# Altium schematic sheet Sheet1.SchDoc
size 594 x 420 mm; PageSetup: Record=PageOptions|CenterHorizontal=True|CenterVertical=True|PrintScale=0.94|XCorrection=1.00|YCorrection=1.00|PrintKind=1|BorderSize=5000000|LeftOffset=0|BottomOffset=0|Orientation=1|PaperLength=1000|PaperWidth=1000|Scale=100|PaperSource=7|PrintQuality=-4|MediaType=1|DitherType=10|PaperKind=A4|PrintScaleMode=1; Address1: Address1; Address2: Address2; Address3: Address3; Address4: Address4; DocumentNumber: 1; SheetNumber: 1; SheetTotal: 5
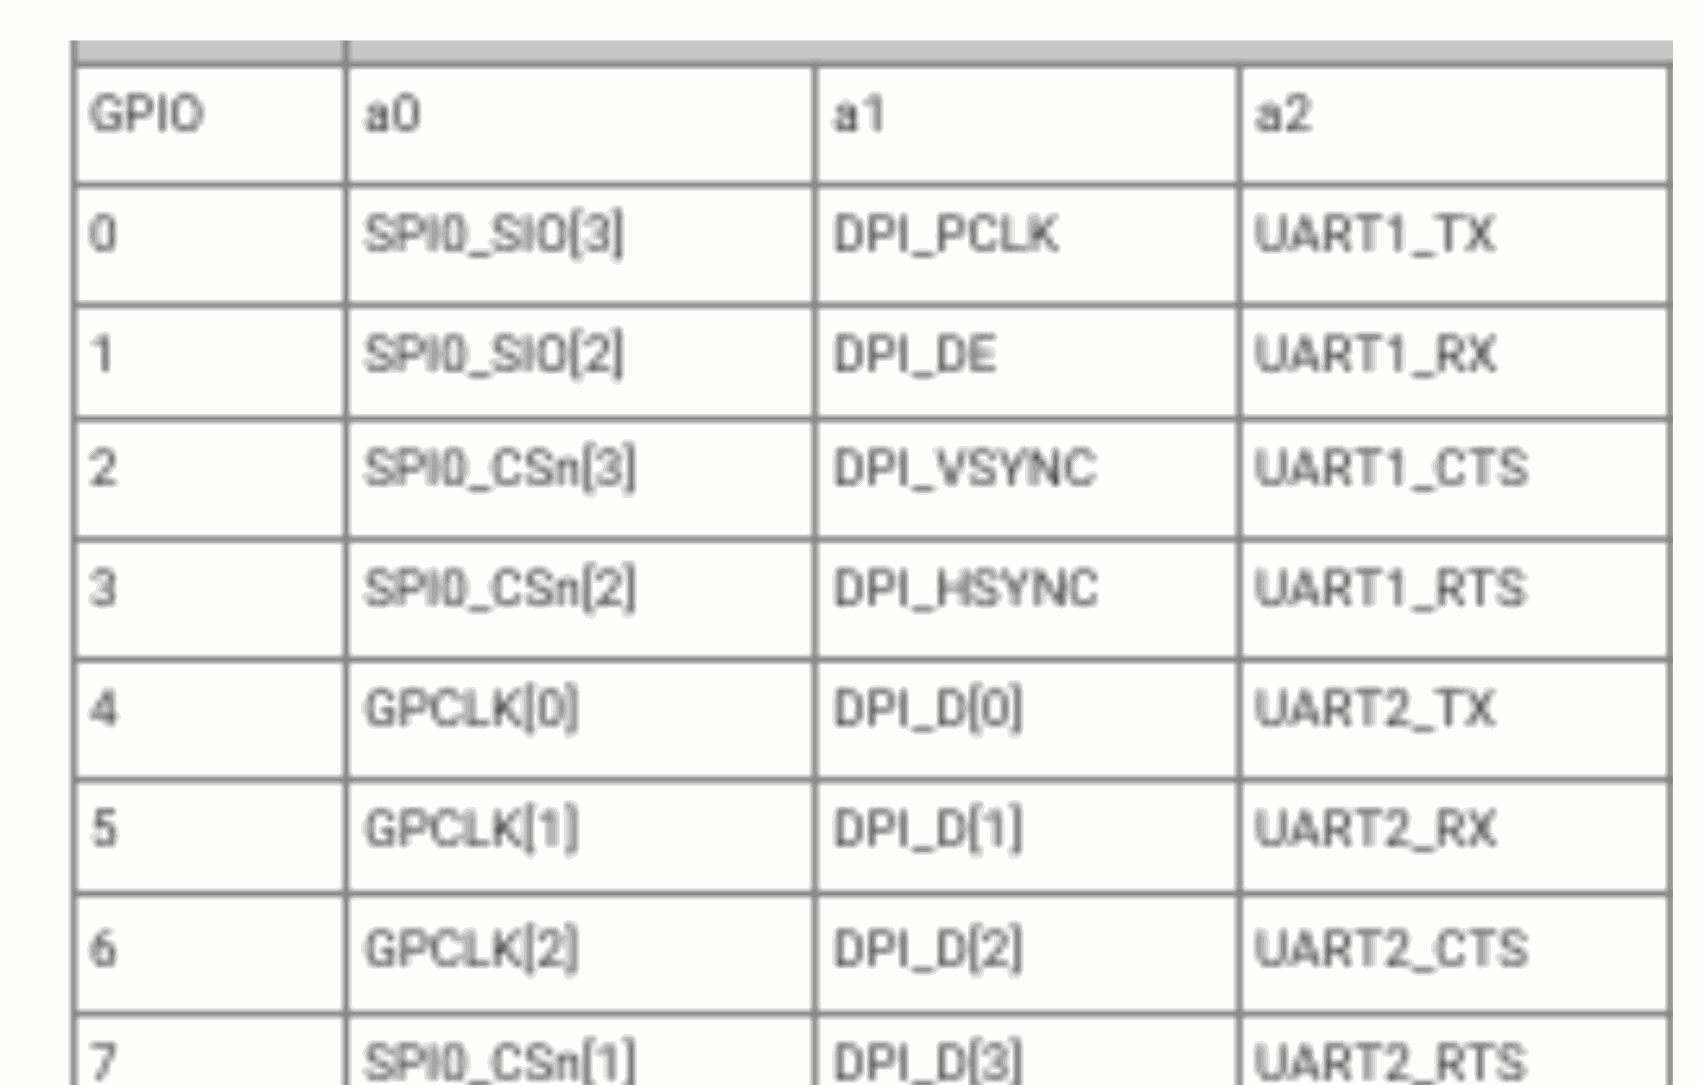
[diagram p0: Sheet1.SchDoc, top left]
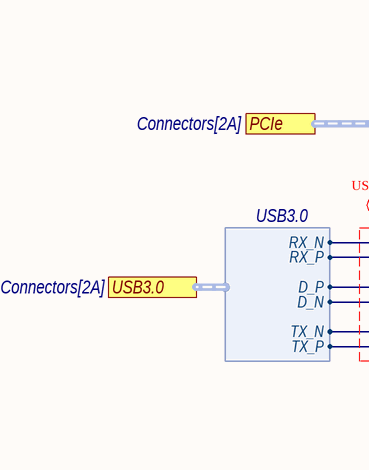
[diagram p1: Sheet1.SchDoc, top middle]
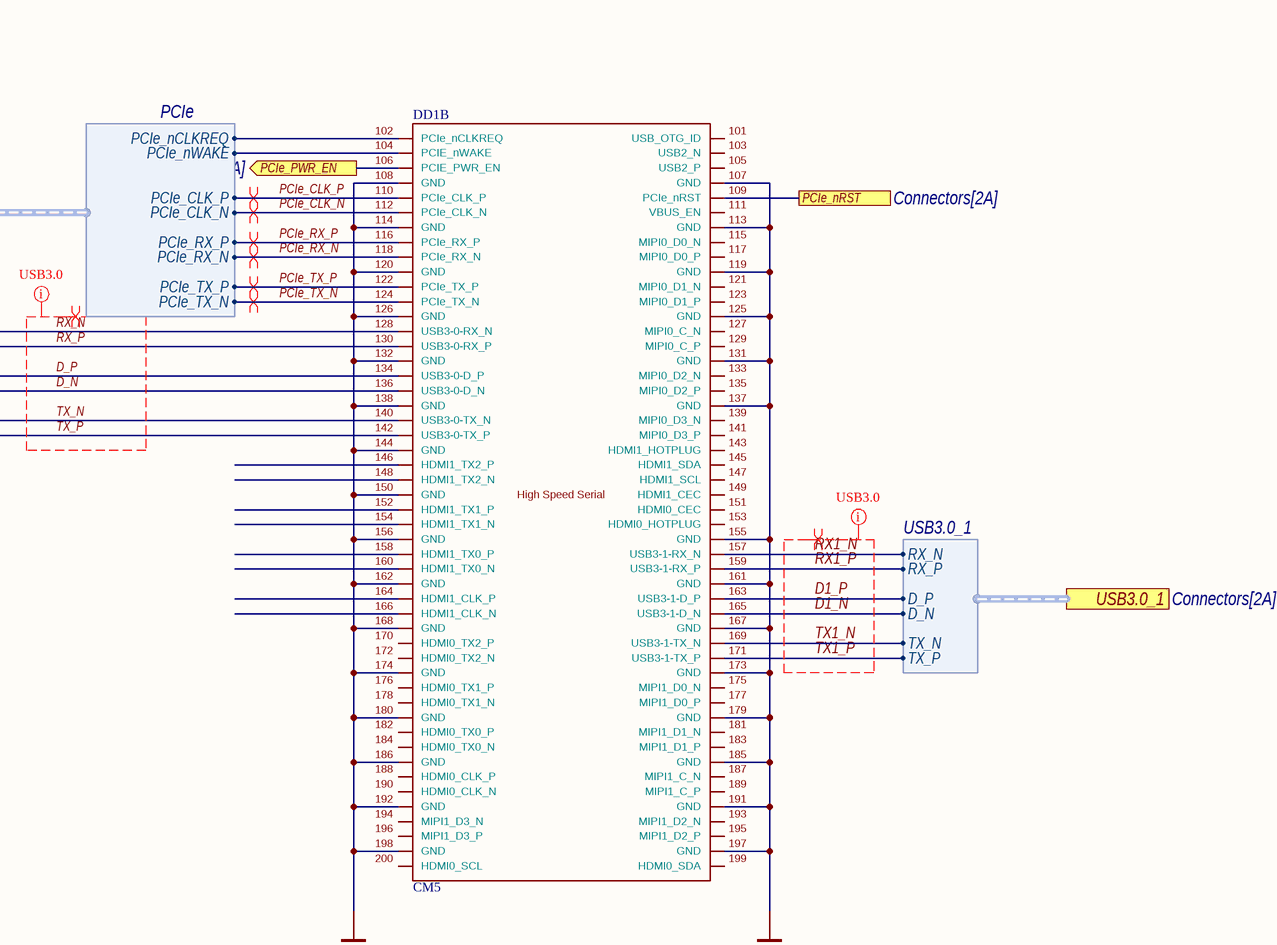
[diagram p2: Sheet1.SchDoc, top right]
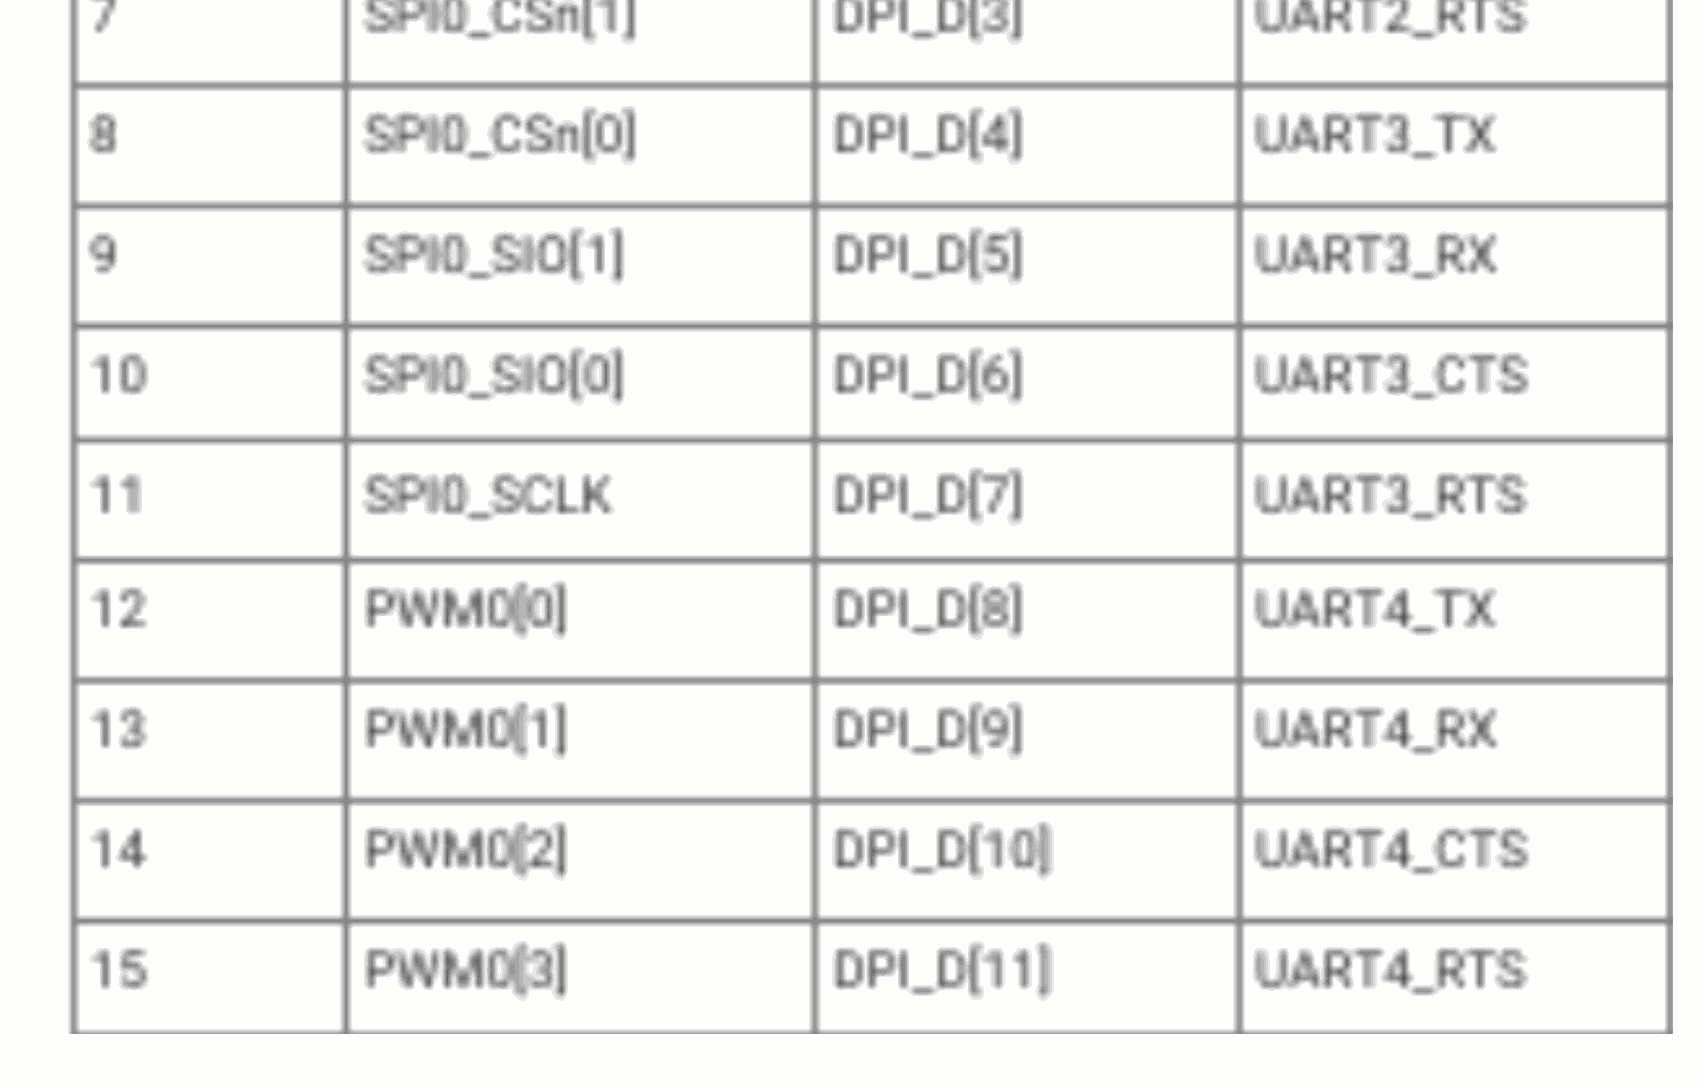
[diagram p3: Sheet1.SchDoc, bottom left]
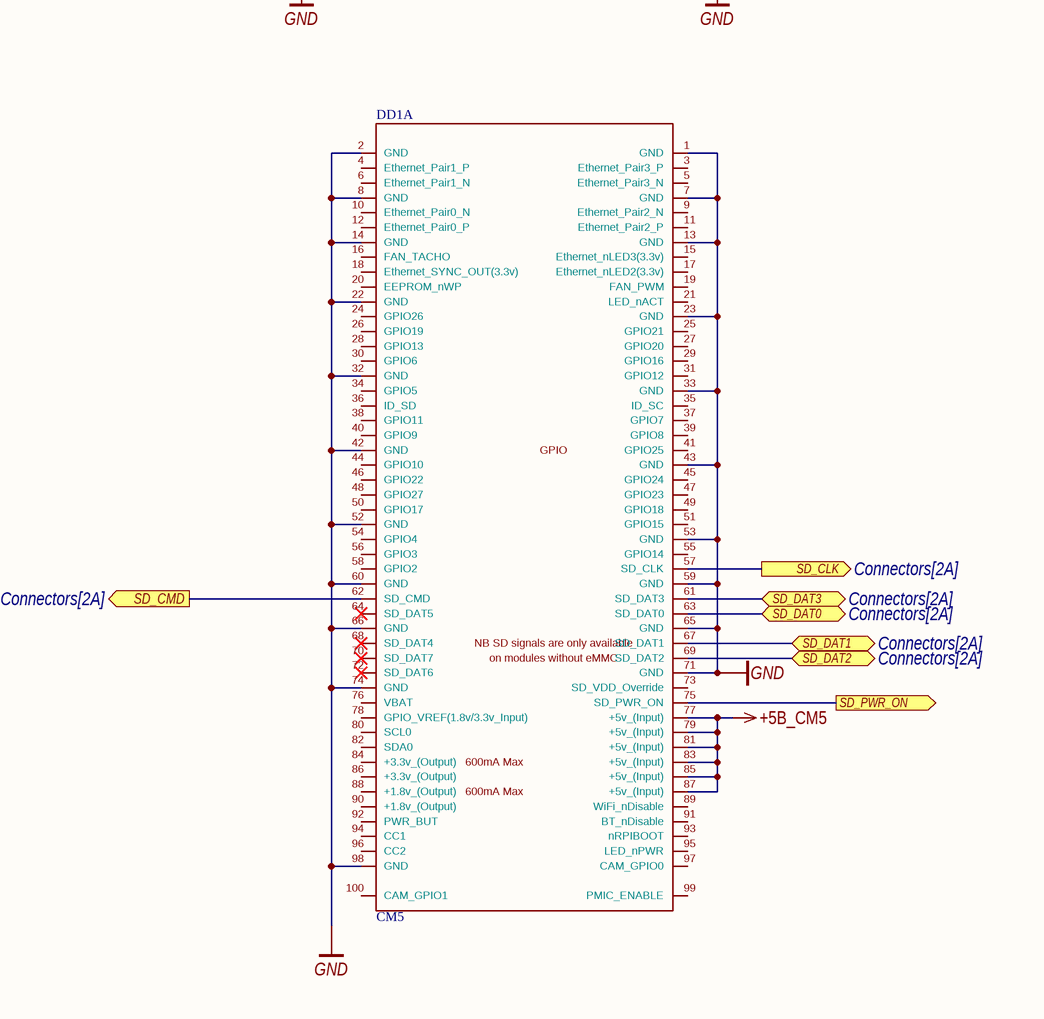
[diagram p4: Sheet1.SchDoc, bottom right]

## Parts
DD1  CM5  [CM4-DF40HC(3.0)-100DS-0.4v_3mm_1.5mm]  (parts A,B of 2)

## Ports
PCIe (harness PCIe, see Connectors[2A]), PCIe_nRST (see Connectors[2A]), PCIe_PWR_EN (out, see Power[2A]), SD_CLK (out, see Connectors[2A]), SD_CMD (out, see Connectors[2A]), SD_DAT0 (bidir, see Connectors[2A]), SD_DAT1 (bidir, see Connectors[2A]), SD_DAT2 (bidir, see Connectors[2A]), SD_DAT3 (bidir, see Connectors[2A]), SD_PWR_ON (out), USB3.0 (harness USB3.0, see Connectors[2A]), USB3.0_1 (harness USB3.0_1, see Connectors[2A])

## Harnesses
USB3.0: RX_N, RX_P, D_P, D_N, TX_N, TX_P
USB3.0_1: RX_N, RX_P, D_P, D_N, TX_N, TX_P
PCIe: PCIe_nCLKREQ, PCIe_nWAKE, PCIe_CLK_P, PCIe_CLK_N, PCIe_RX_P, PCIe_RX_N, PCIe_TX_P, PCIe_TX_N

## Nets
+5В_CM5: DD1.77(+5v_(Input)) DD1.79(+5v_(Input)) DD1.81(+5v_(Input)) DD1.83(+5v_(Input)) DD1.85(+5v_(Input)) DD1.87(+5v_(Input))
GND: DD1.1(GND) DD1.2(GND) DD1.7(GND) DD1.8(GND) DD1.13(GND) DD1.14(GND) DD1.22(GND) DD1.23(GND) DD1.32(GND) DD1.33(GND) DD1.42(GND) DD1.43(GND) DD1.52(GND) DD1.53(GND) DD1.59(GND) DD1.60(GND) DD1.65(GND) DD1.66(GND) DD1.71(GND) DD1.74(GND) DD1.98(GND) DD1.107(GND) DD1.108(GND) DD1.113(GND) DD1.114(GND) DD1.119(GND) DD1.120(GND) DD1.125(GND) DD1.126(GND) DD1.131(GND) DD1.132(GND) DD1.137(GND) DD1.138(GND) DD1.144(GND) DD1.150(GND) DD1.155(GND) DD1.156(GND) DD1.161(GND) DD1.162(GND) DD1.167(GND) DD1.168(GND) DD1.173(GND) DD1.174(GND) DD1.179(GND) DD1.180(GND) DD1.185(GND) DD1.186(GND) DD1.191(GND) DD1.192(GND) DD1.197(GND) DD1.198(GND)
D1_N: DD1.165(USB3-1-D_N) ; port USB3.0_1.D_N
D1_P: DD1.163(USB3-1-D_P) ; port USB3.0_1.D_P
D_N: DD1.136(USB3-0-D_N) ; port USB3.0.D_N
D_P: DD1.134(USB3-0-D_P) ; port USB3.0.D_P
PCIe_CLK_N: DD1.112(PCIe_CLK_N) ; port PCIe.PCIe_CLK_N
PCIe_CLK_P: DD1.110(PCIe_CLK_P) ; port PCIe.PCIe_CLK_P
PCIe_nRST: DD1.109(PCIe_nRST) ; port PCIe_nRST
PCIe_PWR_EN: DD1.106(PCIE_PWR_EN) ; port PCIe_PWR_EN
PCIe_RX_N: DD1.118(PCIe_RX_N) ; port PCIe.PCIe_RX_N
PCIe_RX_P: DD1.116(PCIe_RX_P) ; port PCIe.PCIe_RX_P
PCIe_TX_N: DD1.124(PCIe_TX_N) ; port PCIe.PCIe_TX_N
PCIe_TX_P: DD1.122(PCIe_TX_P) ; port PCIe.PCIe_TX_P
RX1_N: DD1.157(USB3-1-RX_N) ; port USB3.0_1.RX_N
RX1_P: DD1.159(USB3-1-RX_P) ; port USB3.0_1.RX_P
RX_N: DD1.128(USB3-0-RX_N) ; port USB3.0.RX_N
RX_P: DD1.130(USB3-0-RX_P) ; port USB3.0.RX_P
SD_CLK: DD1.57(SD_CLK) ; port SD_CLK
SD_CMD: DD1.62(SD_CMD) ; port SD_CMD
SD_DAT0: DD1.63(SD_DAT0) ; port SD_DAT0
SD_DAT1: DD1.67(SD_DAT1) ; port SD_DAT1
SD_DAT2: DD1.69(SD_DAT2) ; port SD_DAT2
SD_DAT3: DD1.61(SD_DAT3) ; port SD_DAT3
SD_PWR_ON: DD1.75(SD_PWR_ON) ; port SD_PWR_ON
TX1_N: DD1.169(USB3-1-TX_N) ; port USB3.0_1.TX_N
TX1_P: DD1.171(USB3-1-TX_P) ; port USB3.0_1.TX_P
TX_N: DD1.140(USB3-0-TX_N) ; port USB3.0.TX_N
TX_P: DD1.142(USB3-0-TX_P) ; port USB3.0.TX_P
NetDD1_102: DD1.102(PCIe_nCLKREQ) ; port PCIe.PCIe_nCLKREQ
NetDD1_104: DD1.104(PCIE_nWAKE) ; port PCIe.PCIe_nWAKE

Not connected (* = marked no-connect by the designer): DD1 3(Ethernet_Pair3_P) 4(Ethernet_Pair1_P) 5(Ethernet_Pair3_N) 6(Ethernet_Pair1_N) 9(Ethernet_Pair2_N) 10(Ethernet_Pair0_N) 11(Ethernet_Pair2_P) 12(Ethernet_Pair0_P) 15(Ethernet_nLED3(3.3v)) 16(FAN_TACHO) 17(Ethernet_nLED2(3.3v)) 18(Ethernet_SYNC_OUT(3.3v)) 19(FAN_PWM) 20(EEPROM_nWP) 21(LED_nACT) 24(GPIO26) 25(GPIO21) 26(GPIO19) 27(GPIO20) 28(GPIO13) 29(GPIO16) 30(GPIO6) 31(GPIO12) 34(GPIO5) 35(ID_SC) 36(ID_SD) 37(GPIO7) 38(GPIO11) 39(GPIO8) 40(GPIO9) 41(GPIO25) 44(GPIO10) 45(GPIO24) 46(GPIO22) 47(GPIO23) 48(GPIO27) 49(GPIO18) 50(GPIO17) 51(GPIO15) 54(GPIO4) 55(GPIO14) 56(GPIO3) 58(GPIO2) 64(SD_DAT5)* 68(SD_DAT4)* 70(SD_DAT7)* 72(SD_DAT6)* 73(SD_VDD_Override) 76(VBAT) 78(GPIO_VREF(1.8v/3.3v_Input)) 80(SCL0) 82(SDA0) 84(+3.3v_(Output)) 86(+3.3v_(Output)) 88(+1.8v_(Output)) 89(WiFi_nDisable) 90(+1.8v_(Output)) 91(BT_nDisable) 92(PWR_BUT) 93(nRPIBOOT) 94(CC1) 95(LED_nPWR) 96(CC2) 97(CAM_GPIO0) 99(PMIC_ENABLE) 100(CAM_GPIO1) 101(USB_OTG_ID) 103(USB2_N) 105(USB2_P) 111(VBUS_EN) 115(MIPI0_D0_N) 117(MIPI0_D0_P) 121(MIPI0_D1_N) 123(MIPI0_D1_P) 127(MIPI0_C_N) 129(MIPI0_C_P) 133(MIPI0_D2_N) 135(MIPI0_D2_P) 139(MIPI0_D3_N) 141(MIPI0_D3_P) 143(HDMI1_HOTPLUG) 145(HDMI1_SDA) 146(HDMI1_TX2_P) 147(HDMI1_SCL) 148(HDMI1_TX2_N) 149(HDMI1_CEC) 151(HDMI0_CEC) 152(HDMI1_TX1_P) 153(HDMI0_HOTPLUG) 154(HDMI1_TX1_N) 158(HDMI1_TX0_P) 160(HDMI1_TX0_N) 164(HDMI1_CLK_P) 166(HDMI1_CLK_N) 170(HDMI0_TX2_P) 172(HDMI0_TX2_N) 175(MIPI1_D0_N) 176(HDMI0_TX1_P) 177(MIPI1_D0_P) 178(HDMI0_TX1_N) 181(MIPI1_D1_N) 182(HDMI0_TX0_P) 183(MIPI1_D1_P) 184(HDMI0_TX0_N) 187(MIPI1_C_N) 188(HDMI0_CLK_P) 189(MIPI1_C_P) 190(HDMI0_CLK_N) 193(MIPI1_D2_N) 194(MIPI1_D3_N) 195(MIPI1_D2_P) 196(MIPI1_D3_P) 199(HDMI0_SDA) 200(HDMI0_SCL)

## Layout directives
differential pair: D1_N, D1_P, D_N, D_P, PCIe_CLK_N, PCIe_CLK_P, PCIe_RX_N, PCIe_RX_P, PCIe_TX_N, PCIe_TX_P, RX1_N, RX1_P, RX_N, RX_P, TX1_N, TX1_P, TX_N, TX_P
net class USB3.0; Impedance: 90 Ohm: D1_N, D1_P, D_N, D_P, RX1_N, RX1_P, RX_N, RX_P, TX1_N, TX1_P, TX_N, TX_P

## Notes on the sheet
- Перв. примен.
- Справ. №
- Подп. и дата
- Инв. № дубл.
- Взам. инв. №
- Инв. № подл.
- Изм.
- Лист
- № докум.
- Подп.
- Дата
- Копировал
- Формат А2
- (in symbol CM5, part A) GPIO; NB SD signals are only available; on modules without eMMC; 600mA Max
- (in symbol CM5, part B) High Speed Serial

## Library data of the parts
DD1 = CM5: Part Number: CM5